# Altium schematic sheet 电机小板（霍尔编码器）的原理图.SchDoc
size A4
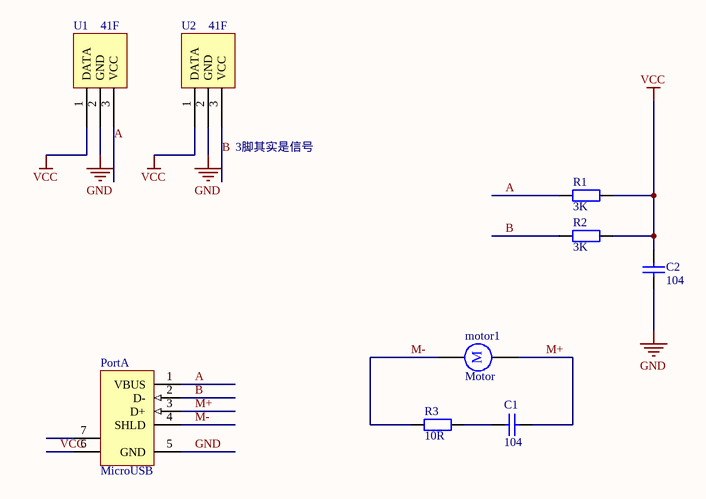
[diagram p0: 电机小板（霍尔编码器）的原理图.SchDoc]

## Parts
C1  value 104  [0805]  (hidden comment: Cap)
C2  value 104  [0805]  (hidden comment: Cap)
motor1  Motor  [RB5-10.5]
PortA  MicroUSB  [USB6P]
R1  value 3K  [0805]  (hidden comment: res2)
R2  value 3K  [0805]  (hidden comment: res2)
R3  value 10R  [0805]  (hidden comment: res2)
U1  41F  [HS0038]
U2  41F  [HS0038]

## Nets
GND: C2.2 PortA.5(GND) U1.2(GND) U2.2(GND)
VCC: C2.1 PortA.6(SHLD) R1.2 R2.2 U1.1(DATA) U2.1(DATA)
A: PortA.1(VBUS) R1.1 U1.3(VCC)
B: PortA.2(D-) R2.1 U2.3(VCC)
M+: C1.1 motor1.2 PortA.3(D+)
M-: motor1.1 PortA.4(SHLD) R3.1
NetC1_2: C1.2 R3.2

Not connected (* = marked no-connect by the designer): PortA 7(SHLD)

## Notes on the sheet
- 3脚其实是信号
- (in symbol Motor) M

## Library data of the parts
C1 C2 = Cap: Capacitor; Published: 8-Jun-2000; LatestRevisionDate: 17-Jul-2002; LatestRevisionNote: Re-released for DXP Platform.; PackageReference: RAD-0.3; Publisher: Altium Limited
motor1 = Motor: Motor, General Kind; Published: 24-Mar-1999; LatestRevisionDate: 17-Jul-2002; LatestRevisionNote: Re-released for DXP Platform.; PackageReference: RB5-10.5; Publisher: Altium Limited
PortA = 440478-2: USB 2.0, Right Angle, SMT, A Type, Receptacle, 5 Position, Black; ContactMaterial: Phosphor Bronze; ContactPlating: Gold (30) over Nickel; PCB_Layout: Complies with manufacturer's recommendation.; DrillSize: Corresponds to nominal value.; PanelGround: Without; Published: 15-Jul-2004; DatasheetDocument: 15-Nov-2002; PackageDocument: 15-Nov-2002; PackageReference: 440478; Publisher: Altium Limited; HousingMaterial: Thermoplastic; ComponentLink1Description: Manufacturer Link; ComponentLink1URL: http://www.tycoelectronics.com/; ComponentLink2Description: Packaging Specification; ComponentLink2URL: http://ecommas.tycoelectronics.com/commerce/DocumentDelivery/DDEController?Action=showdoc&DocId=Customer+Drawing%7F440478%7FB%7Fpdf%7FEnglish%7FC_440478_B.pdf
R1-R3 = res2: Resistor; Published: 8-Jun-2000; LatestRevisionDate: 17-Jul-2002; LatestRevisionNote: Re-released for DXP Platform.; PackageReference: AXIAL-0.4; Publisher: Altium Limited
U1 U2 = HS0038